# Altium project BackDrill - Brendan Cook.PrjPcb
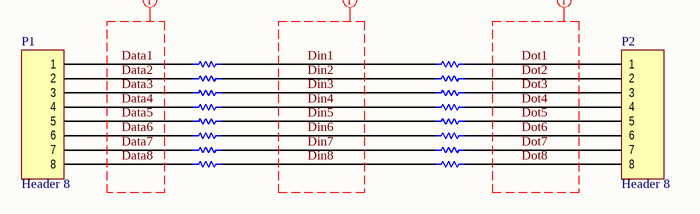
[diagram p0:  Back Drill Example.SchDoc]
1 sheet, 18 parts. Net scope: global (net labels, ports and power ports of the same name join across sheets).
Board file:  BackDrill.PcbDoc

## Sheet  Back Drill Example.SchDoc: Back Drill Schematics
size 431 x 279 mm; Author: Sharp Edges; Organization: Altium Limited; Address1: L3, 12a Rodborough Rd; Address2: Frenchs Forest; Address3: NSW; Address4: Australia 2086; DocumentNumber: 1; Revision: 1.0; SheetNumber: 1; SheetTotal: 1

### Parts
P1  Header 8  [HDR1X8]
P2  Header 8  [HDR1X8]
R1  1K 0603  [0603_L]  (value not drawn)
R2  1K 0603  [0603_L]  (value not drawn)
R3  1K 0603  [0603_L]  (value not drawn)
R4  1K 0603  [0603_L]  (value not drawn)
R5  1K 0603  [0603_L]  (value not drawn)
R6  1K 0603  [0603_L]  (value not drawn)
R7  1K 0603  [0603_L]  (value not drawn)
R8  1K 0603  [0603_L]  (value not drawn)
RS1  1K 0603  [0603_L]  (value not drawn)
RS2  1K 0603  [0603_L]  (value not drawn)
RS3  1K 0603  [0603_L]  (value not drawn)
RS4  1K 0603  [0603_L]  (value not drawn)
RS5  1K 0603  [0603_L]  (value not drawn)
RS6  1K 0603  [0603_L]  (value not drawn)
RS7  1K 0603  [0603_L]  (value not drawn)
RS8  1K 0603  [0603_L]  (value not drawn)

### Nets
Data1: P1.1 R1.1
Data2: P1.2 R2.1
Data3: P1.3 R3.1
Data4: P1.4 R4.1
Data5: P1.5 R5.1
Data6: P1.6 R6.1
Data7: P1.7 R7.1
Data8: P1.8 R8.1
Din1: R1.2 RS1.1
Din2: R2.2 RS2.1
Din3: R3.2 RS3.1
Din4: R4.2 RS4.1
Din5: R5.2 RS5.1
Din6: R6.2 RS6.1
Din7: R7.2 RS7.1
Din8: R8.2 RS8.1
Dot1: P2.1 RS1.2
Dot2: P2.2 RS2.2
Dot3: P2.3 RS3.2
Dot4: P2.4 RS4.2
Dot5: P2.5 RS5.2
Dot6: P2.6 RS6.2
Dot7: P2.7 RS7.2
Dot8: P2.8 RS8.2

### Layout directives
net class HSdata: Data1, Data2, Data3, Data4, Data5, Data6, Data7, Data8, Din1, Din2, Din3, Din4, Din5, Din6, Din7, Din8, Dot1, Dot2, Dot3, Dot4, Dot5, Dot6, Dot7, Dot8

### Notes on the sheet
- 8
- 7
- 6
- 5
- 4
- 3
- DWG. NO.
- REV.
- SHT.
- 2
- 1
- THIS DOCUMENT AND THE DATA DISCLOSED HEREIN OR HEREWITH IS THE PROPERTY OF ALTIUM LIMITED AND MAY BE FREELY DISTRIBUTED IN WHOLE. NO RIGHTS ARE RESERVED OR EXPRESS OR IMPLIED WARANTEE GIVEN.
- REVISION
- DESCRIPTION
- DATE
- APPROVED
- F
- E
- D
- C
- B
- ENG:
- APPROVALS
- PROJECT
- A
- DSN:
- CHK:
- REFERENCE DOCUMENTS
- PROJECT REVISION:
- TITLE
- DOCUMENT REVISION:
- DESIGN ITEM:
- BOM:
- FAB DWG:
- PCB DWG:
- ASSY DWG:
- SCALE:
- SIZE
- CAGE CODE
- FILE NAME
- DWG NO.
- SHEET
- OF
- REV

### Library data of the parts
P1 P2 = Header 8: Header, 8-Pin; LatestRevisionDate: 17-Jul-2002; LatestRevisionNote: Re-released for DXP Platform.; Publisher: Altium Limited
R1-R8 RS1-RS8 = Res1K_0603: Manufacturer: Panasonic Electronic Components; Manufacturer Part Number: ERJ-3GEYJ102V; Tolerance: ±5%; Power (Watts): 0.1W, 1/10W; Temperature Coefficient: ±200ppm/°C; Supplier 1: Digi-Key; RoHS: RoHS Compliant; Category: Resistors; Stock 1: 1335381; Pricing 1: 1=0.1, 50=0.0096, 100=0.0071, 250=0.00544, 500=0.00436, 1000=0.00321 (USD); Packaging: Cut Tape (CT); Part Status: Active; Resistance (Ohms): 1k; Composition: Thick Film; Features: Automotive AEC-Q200; Operating Temperature: -55°C ~ 155°C; Package / Case: 0603 (1608 Metric); Supplier Device Package: 0603; Size / Dimension: 0.063" L x 0.031" W (1.60mm x 0.80mm); Height: 0.022" (0.55mm); Number of Terminations: 2; Failure Rate: -; ComponentLink1URL: http://industrial.panasonic.com/www-cgi/jvcr13pz.cgi?E+PZ+3+AOA0001+ERJ3GEYJ102V+7+WW; ComponentLink1Description: http://industrial.panasonic.com/www-cgi/jvcr13pz.cgi?E+PZ+3+AOA0001+ERJ3GEYJ102V+7+WW; Supplier Part Number 1: P1.0KGCT-ND